# Altium schematic sheet Schematic.SchDoc
size A4
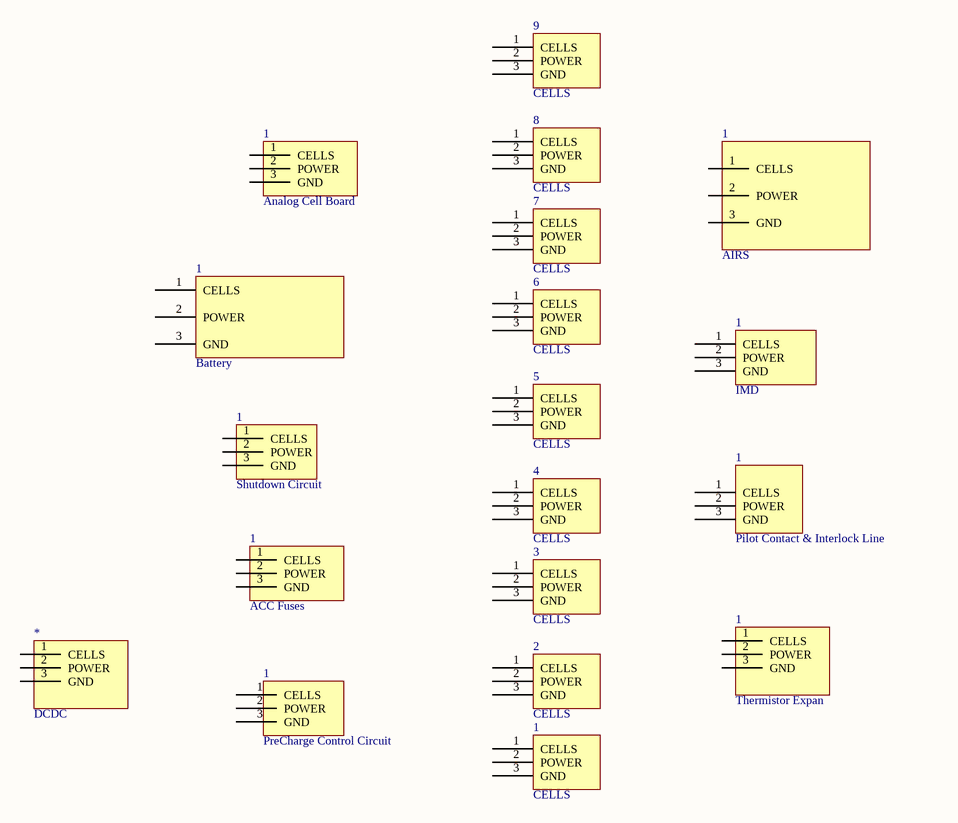
[diagram p0: Schematic.SchDoc]

## Parts
(Parts that share a designator on the sheet are numbered #1, #2 ... from top to bottom, then left to right.)
1#1  Analog Cell Board
1#2  AIRS
1#3  Battery
1#4  IMD
1#5  Shutdown Circuit
1#6  Pilot Contact & Interlock Line
1#7  ACC Fuses
1#8  Thermistor Expan
1#9  PreCharge Control Circuit
1#10  CELLS
2  CELLS
3  CELLS
4  CELLS
5  CELLS
6  CELLS
7  CELLS
8  CELLS
9  CELLS
*  DCDC

## Nets

Not connected (* = marked no-connect by the designer): 1#1 1(CELLS) 2(POWER) 3(GND); 1#2 1(CELLS) 2(POWER) 3(GND); 1#3 1(CELLS) 2(POWER) 3(GND); 1#4 1(CELLS) 2(POWER) 3(GND); 1#5 1(CELLS) 2(POWER) 3(GND); 1#6 1(CELLS) 2(POWER) 3(GND); 1#7 1(CELLS) 2(POWER) 3(GND); 1#8 1(CELLS) 2(POWER) 3(GND); 1#9 1(CELLS) 2(POWER) 3(GND); 1#10 1(CELLS) 2(POWER) 3(GND); 2 1(CELLS) 2(POWER) 3(GND); 3 1(CELLS) 2(POWER) 3(GND); 4 1(CELLS) 2(POWER) 3(GND); 5 1(CELLS) 2(POWER) 3(GND); 6 1(CELLS) 2(POWER) 3(GND); 7 1(CELLS) 2(POWER) 3(GND); 8 1(CELLS) 2(POWER) 3(GND); 9 1(CELLS) 2(POWER) 3(GND); * 1(CELLS) 2(POWER) 3(GND)

## Library data of the parts
1#10 2-9 = BMS